# Altium project soldeerbout.PrjPcb
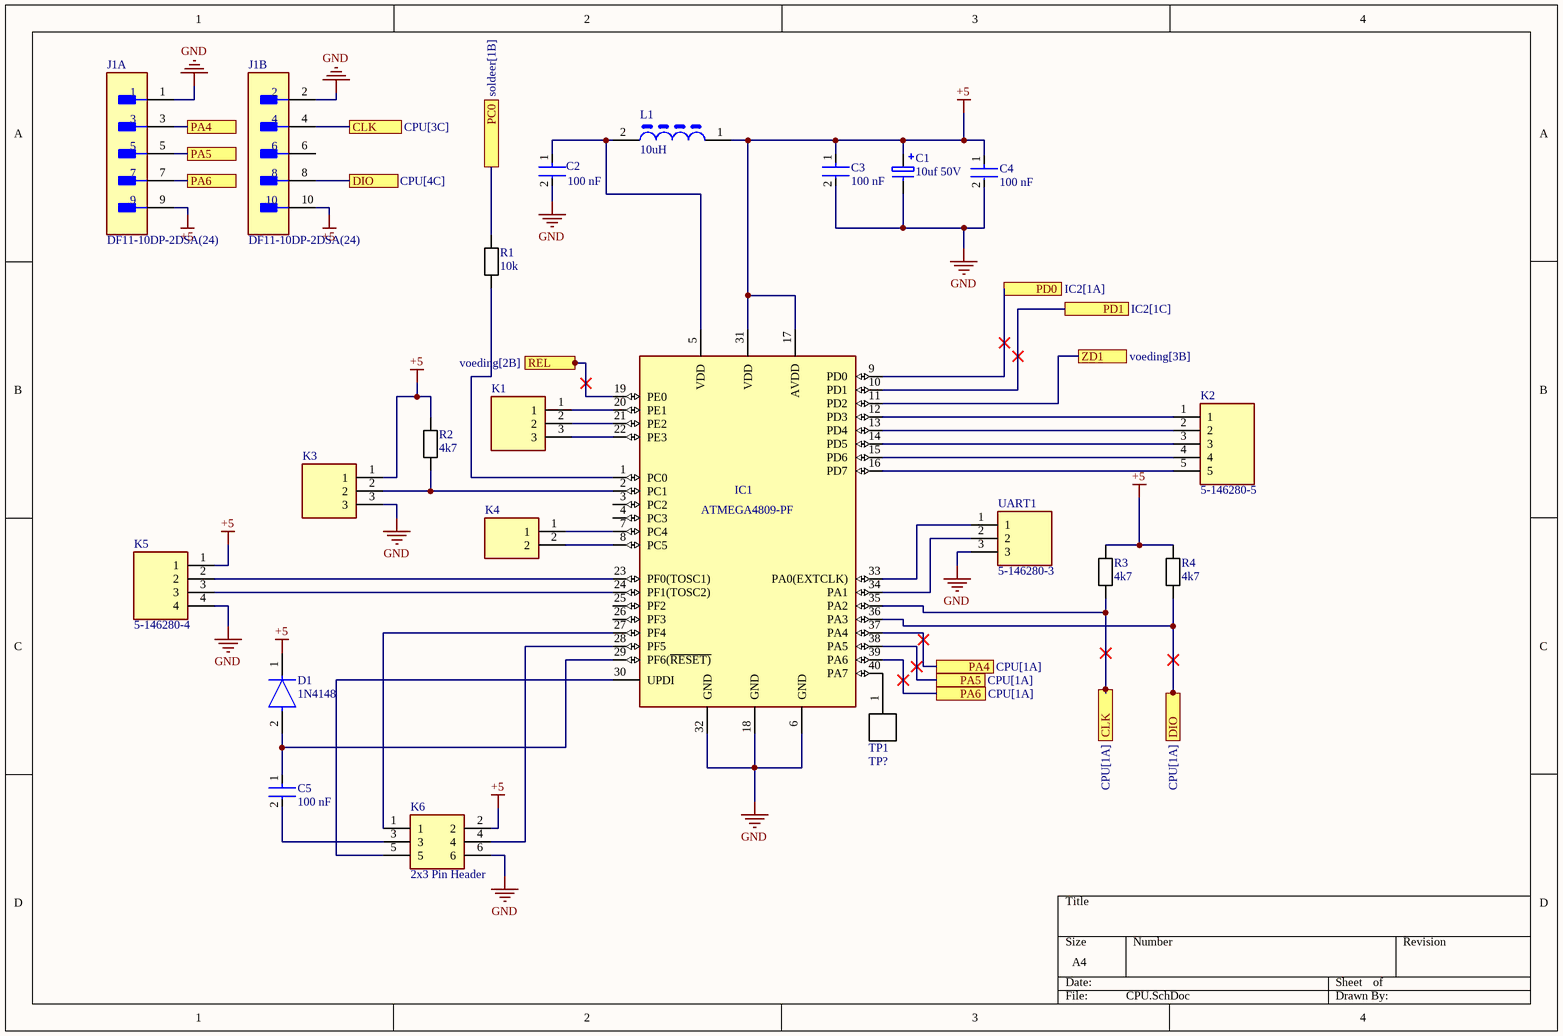
[diagram p0: CPU.SchDoc]
4 sheets, 71 parts. Net scope: flat (ports and power ports of the same name join across sheets).
Board file: PCB1.PcbDoc
Sheets:
  CPU.SchDoc
  IC2.SchDoc
  soldeer.SchDoc
  voeding.SchDoc

## Sheet CPU.SchDoc
size A4; SheetNumber: 1; SheetTotal: 4

### Parts
C1  10uf 50V  [Elco 10uF 50V]
C2  100 nF  [0805]
C3  100 nF  [0805]
C4  100 nF  [0805]
C5  100 nF  [0805]
D1  1N4148  [1N4148]
IC1  ATMEGA4809-PF  [FP-C04-016-MFG]
J1  DF11-10DP-2DSA(24)  [FP-DF11-10DP-2DSA_24-MFG - duplicate]  (parts A,B of 2)
K1  5-146280-3  [3 Pin Header]  (value not drawn)
K2  5-146280-5  [5 Pin Header]
K3  5-146280-3  [3 Pin Header]  (value not drawn)
K4  5-146280-2  [2 Pin Header]  (value not drawn)
K5  5-146280-4  [4 Pin Header]
K6  2x3 Pin Header  [2x3 Pin Header]
L1  10uH  [Smoorspoel]
R1  10k  [registor]
R2  4k7  [registor]
R3  4k7  [registor]
R4  4k7  [registor]
TP1  TP?  [testpunt]
UART1  5-146280-3  [3 Pin Header]

### Ports
CLK (see CPU[1A]), CLK (see CPU[3C]), DIO (see CPU[1A]), DIO (see CPU[4C]), PA4 (see CPU[1A]), PA4 (see CPU[3C]), PA5 (see CPU[1A]), PA5 (see CPU[3C]), PA6 (see CPU[1A]), PA6 (see CPU[3C]), PC0 (see soldeer[1B]), PD0 (see IC2[1A]), PD1 (see IC2[1C]), REL (see voeding[2B]), ZD1 (see voeding[3B])

### Nets
+5: C1.1 C3.1 C4.1 D1.1(C) IC1.17(AVDD) IC1.31(VDD) J1.9 J1.10 K3.1 K5.1 K6.2 L1.1 R2.2 R3.2 R4.2
GND: C1.2 C2.2 C3.2 C4.2 IC1.6(GND) IC1.18(GND) IC1.32(GND) J1.1 J1.2 K3.3 K5.4 K6.6 UART1.3
NetC2_1: C2.1 IC1.5(VDD) L1.2
NetC5_1: C5.1 D1.2(A) IC1.29(PF6(~{RESET)})
NetC5_2: C5.2 K6.3
NetC7_1: IC1.9(PD0) ; port PD0
NetC9_1: IC1.10(PD1) ; port PD1
NetIC1_1: IC1.1(PC0) R1.1
NetIC1_2: IC1.2(PC1) K3.2 R2.1
NetIC1_7: IC1.7(PC4) K4.1
NetIC1_8: IC1.8(PC5) K4.2
NetIC1_11: IC1.11(PD2) ; port ZD1
NetIC1_12: IC1.12(PD3) K2.1
NetIC1_13: IC1.13(PD4) K2.2
NetIC1_14: IC1.14(PD5) K2.3
NetIC1_15: IC1.15(PD6) K2.4
NetIC1_16: IC1.16(PD7) K2.5
NetIC1_19: IC1.19(PE0) ; port REL
NetIC1_20: IC1.20(PE1) K1.1
NetIC1_21: IC1.21(PE2) K1.2
NetIC1_22: IC1.22(PE3) K1.3
NetIC1_23: IC1.23(PF0(TOSC1)) K5.2
NetIC1_24: IC1.24(PF1(TOSC2)) K5.3
NetIC1_27: IC1.27(PF4) K6.1
NetIC1_28: IC1.28(PF5) K6.4
NetIC1_30: IC1.30(UPDI) K6.5
NetIC1_33: IC1.33(PA0(EXTCLK)) UART1.1
NetIC1_34: IC1.34(PA1) UART1.2
NetIC1_35: IC1.35(PA2) J1.4 R3.1 ; port CLK
NetIC1_36: IC1.36(PA3) J1.8 R4.1 ; port DIO
NetIC1_37: IC1.37(PA4) J1.3 ; port PA4
NetIC1_38: IC1.38(PA5) J1.5 ; port PA5
NetIC1_39: IC1.39(PA6) J1.7 ; port PA6
NetIC1_40: IC1.40(PA7) TP1.1
NetR1_2: R1.2 ; port PC0

Not connected (* = marked no-connect by the designer): IC1 3(PC2) 4(PC3) 25(PF2) 26(PF3); J1 6

### Library data of the parts
C1 = Condensator 10uf 50V: Part Number: 02015A270JAT2A; Manufacturer: AVX Interconnect / Elco
C2-C5 = Condensator 0805: Chip Multilayer Ceramic Capacitors for General Purpose, 0805, 10uF, X5R, 15%, 10%, 25V; Length: 2mm; Depth: 1.25mm; Termination: SMD/SMT; Voltage: 25V; Height: 1.25mm; Material: Ceramic; Thickness: 0.053inch; Radiation Hardening: No; Min Operating Temperature: -55°C; Width: 0.049inch; Package Quantity: 1; Mount: Surface Mount; Dielectric: X5R; Packaging: Tape and Reel; Capacitance: 10uF; Voltage Rating (DC): 25V; Lead Free: Lead Free; Max Operating Temperature: 85°C; Case Code (Imperial): 0805; Case/Package: 0805; Tolerance: 10%; Voltage Rating: 25V; Case Code (Metric): 2012
D1 = 1N4148: DIODE GEN PURP 100V 200MA DO35; Forward Voltage: 1V; Max Power Dissipation: 500mW; Max Reverse Current: 5uA; Forward Current: 300mA; Current: 4A; Reverse Recovery Time: 4ns; Element Configuration: Single; Outside Diameter: 1.85mm; Capacitance: 4pF; Polarity: Standard; Max Forward Surge Current (Ifsm): 1A; Reverse Voltage: 100V; Output Current: 200mA; Average Rectified Current: 200mA; Diameter: 1.91mm; Max Repetitive Reverse Voltage (Vrrm): 100V; Current Rating: 200mA; Case/Package: DO-35; Lead Free: Lead Free; Number of Pins: 2; Recovery Time: 4ns; Packaging: Bulk; Contact Plating: Tin; Voltage: 100V; Mount: Through Hole; Max Surge Current: 4A; Package Quantity: 2000; Width: 1.91mm; Max Reverse Voltage (DC): 100V; Length: 4.56mm; Radiation Hardening: No; Power Dissipation: 500mW; Voltage Rating (DC): 100V; Peak Non-Repetitive Surge Current: 4A; REACH SVHC: No SVHC; Height: 4.56mm; Max Operating Temperature: 175°C; Series: -; Weight: 0.01lb; Min Operating Temperature: -65°C
IC1 = CMP-06276-000616-1: IC MCU 8BIT 48KB FLASH 40DIP; RoHS Compliant: Yes
J1 = CMP-11610-000008-1: CONN HEADER VERT 10POS 2MM; Manufacturer: Hirose; Number Of Contacts: 10; Voltage Rating: 250V; Conn Orientation: Straight; Conn Gender: Male; Current Rating: 2A; Temperature Range High: +85°C; RoHS: TRUE; Device Class L2: Headers and Wire Housings; ComponentLink2URL: https://www.hirose.com/product/document?clcode=CL0543-0520-0-24&productname=DF11-10DP-2DSA(24)&series=DF11&documenttype=Catalog&lang=en&documentid=D31688_en; Height: 6.9mm; Package: DF11-10DP-2DSA(24); ComponentLink2Description: Datasheet; Automotive: No; Digikey Description: CONN HEADER VERT 10POS 2MM; Manufacturer Part Number: DF11-10DP-2DSA(24); Temperature: -40°C to +85°C; Octopart: https://octopart.com/df11-10dp-2dsa%2824%29-hirose-39521433; Number Of Rows: 2; Device Class L3: unset; Contact Material: Tin,Nickel; Mouser Description: Headers & Wire Housings 10P STRT HEADER THRU HL,BD MNT,SN; Category: Conn; Device Class L1: Connectors; Temperature Range Low: -40°C; Pitch: 2mm; Lead Free: Yes; Footprint Url: https://www.hirose.com/product/document?clcode=CL0543-0520-0-24&productname=DF11-10DP-2DSA(24)&series=DF11&documenttype=2DDrawing&lang=en&documentid=0000995333
K1 K3 UART1 = 3 Pin Header L: Connector 5-146280-3; Manufacturer_Name: TE Connectivity; Datasheet Link: https://componentsearchengine.com//5-146280-3.pdf; Height: 8.21mm; Mouser2 Part Number: 571-5-146280-3; Mouser2 Price/Stock: https://www.mouser.com/Search/Refine.aspx?Keyword=571-5-146280-3; Manufacturer_Part_Number: 5-146280-3
K2 = 5 Pin Header: Connector 5-146280-5; Manufacturer_Name: TE Connectivity; Datasheet Link: https://componentsearchengine.com//5-146280-5.pdf; Height: 8.21mm; Mouser2 Part Number: 571-5-146280-5; Mouser2 Price/Stock: https://www.mouser.com/Search/Refine.aspx?Keyword=571-5-146280-5; Manufacturer_Part_Number: 5-146280-5
K4 = 2 Pin Header L: Connector; Manufacturer_Name: TE Connectivity; Datasheet Link: http://www.te.com/commerce/DocumentDelivery/DDEController?Action=showdoc&DocId=Customer+Drawing%7F146280%7FH2%7Fpdf%7FEnglish%7FENG_CD_146280_H2.pdf%7F5-146280-2; Height: 8.72mm; Manufacturer_Part_Number: 5-146280-2
K5 = 4 Pin Header L: Connector 5-146280-4; Manufacturer_Name: TE Connectivity; Datasheet Link: https://datasheet.datasheetarchive.com/originals/distributors/DKDS-20/396066.pdf; Height: 8.21mm; Manufacturer_Part_Number: 5-146280-4
K6 = 2x3 Pin Header: Connector; Manufacturer_Name: TE Connectivity; Manufacturer_Part_Number: 5-146256-3; Datasheet Link: https://www.te.com/commerce/DocumentDelivery/DDEController?Action=srchrtrv&DocNm=146256&DocType=Customer+Drawing&DocLang=English; Height: 8.72mm
L1 = Smoorspoel: Inductor VLS6045EX-100M-H; Manufacturer_Name: TDK; Datasheet Link: https://componentsearchengine.com//VLS6045EX-100M-H.pdf; Mouser2 Part Number: 810-VLS6045EX-100M-H; Mouser2 Price/Stock: https://www.mouser.com/Search/Refine.aspx?Keyword=810-VLS6045EX-100M-H; Manufacturer_Part_Number: VLS6045EX-100M-H
R1-R4 = resistor: Manufacturer: Vishay Dale; Part Number: CRCW08050000Z0EA
TP1 = testpunt

## Sheet IC2.SchDoc
size A4; SheetNumber: 2; SheetTotal: 4
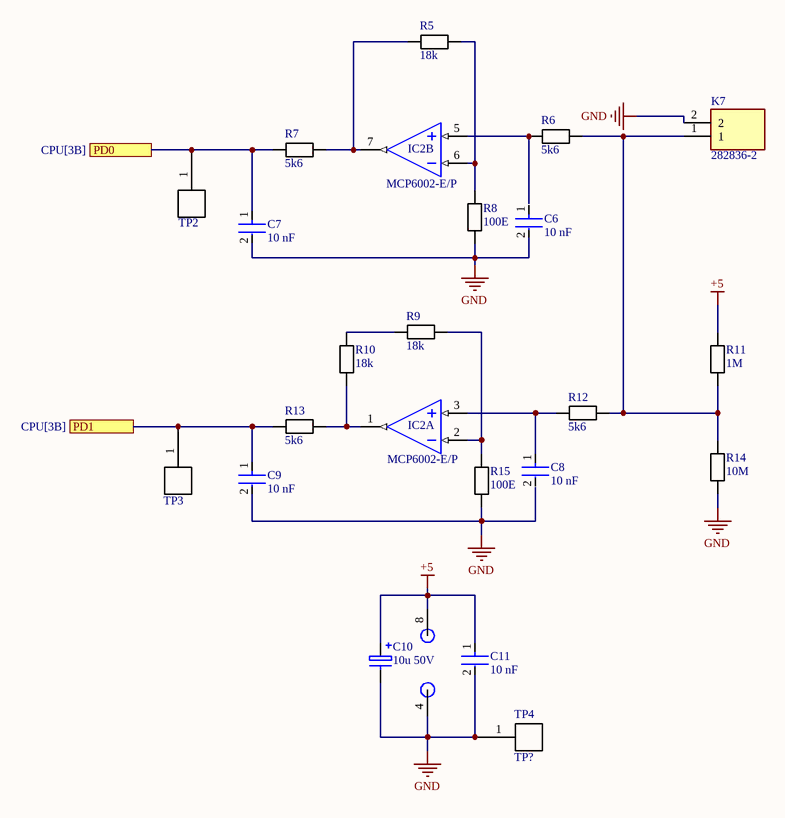
[diagram p1: IC2.SchDoc]

### Parts
C6  10 nF  [0805]
C7  10 nF  [0805]
C8  10 nF  [0805]
C9  10 nF  [0805]
C10  10u 50V  [Elco 10uF 50V]
C11  10 nF  [0805]
IC2  MCP6002-E/P  [MCP6002-E/P]  (parts A,B of 2)
K7  282836-2  [Schroefconnector 2 Pin]
R5  18k  [registor]
R6  5k6  [registor]
R7  5k6  [registor]
R8  100E  [registor]
R9  18k  [registor]
R10  18k  [registor]
R11  1M  [registor]
R12  5k6  [registor]
R13  5k6  [registor]
R14  10M  [registor]
R15  100E  [registor]
TP2  TP2  [testpunt]  (value not drawn)
TP3  TP?  [testpunt]  (value not drawn)
TP4  TP?  [testpunt]

### Ports
PD0 (see CPU[3B]), PD1 (see CPU[3B])

### Nets
+5: C10.1 C11.1 IC2.8 R11.1
GND: C6.2 C7.2 C9.2 C10.2 C11.2 IC2.4 K7.2 R8.1 R14.1 R15.1 TP4.1
NetC7_1: C7.1 R7.1 TP2.1 ; port PD0
NetC8_1: C8.1 IC2.3(VINA+) R12.1
NetC9_1: C9.1 R13.1 TP3.1 ; port PD1
NetIC2_1: IC2.1(VOUTA) R10.2 R13.2
NetIC2_2: IC2.2(VINA-) R9.1 R15.2
NetIC2_5: IC2.5(VINB+) R6.1
NetIC2_6: IC2.6(VINB-) R5.2 R8.2
NetIC2_7: IC2.7(VOUTB) R5.1 R7.2
NetK7_1: K7.1 R6.2 R11.2 R12.2 R14.2
NetR9_2: R9.2 R10.1

Not connected (* = marked no-connect by the designer): C6 1; C8 2

### Library data of the parts
C6-C9 C11 = Condensator 0805: as C2 on sheet CPU; Length: 2mm; Depth: 1.25mm; Termination: SMD/SMT; Voltage: 25V; Height: 1.25mm; Material: Ceramic; Thickness: 0.053inch; Radiation Hardening: No; Min Operating Temperature: -55°C; Width: 0.049inch; Package Quantity: 1; Mount: Surface Mount; Dielectric: X5R; Packaging: Tape and Reel; Capacitance: 10uF; Voltage Rating (DC): 25V; Lead Free: Lead Free; Max Operating Temperature: 85°C; Case Code (Imperial): 0805; Case/Package: 0805; Tolerance: 10%; Voltage Rating: 25V; Case Code (Metric): 2012
C10 = Condensator Elco: Part Number: 02015A270JAT2A; Manufacturer: AVX Interconnect / Elco
IC2 = MCP6002-E/P: None; Slew Rate: 0.6V/µs; Supply Current: 100uA; Power Supply Rejection Ratio (PSRR): 86dB; Input Offset Voltage (Vos): 4.5mV; Input Bias Current: 1pA; Amplifier Type: GENERAL PURPOSE; Unity Gain Bandwidth Product: 1MHz; Number of Circuits: 2; Output Current: 23mA; Operating Supply Voltage: 5.5V; Min Supply Voltage: 1.8V; Common Mode Rejection Ratio: 60dB; Voltage Gain: 112dB; Max Supply Voltage: 6V; Package Quantity: 60; REACH SVHC: No SVHC; Min Operating Temperature: -40°C; Max Operating Temperature: 125°C; Mount: Through Hole; Nominal Supply Current: 100uA; Height: 3.3mm; Length: 9.27mm; Slew Rate-Nom: 0.6V/µs; Packaging: Rail/Tube; Output Current per Channel: 23mA; Number of Amplifiers: 2; RoHS Compliant: Yes; Radiation Hardening: No; Bandwidth: 1MHz; Lead Free: Lead Free; Width: 6.35mm; Number of Channels: 2; Gain Bandwidth Product: 1MHz; Technology: CMOS; Operating Supply Current: 100uA; Number of Elements: 2; Number of Pins: 8; Input Offset Voltage-Max: 4.5mV; Case/Package: PDIP
K7 = Schroefconnector 2 Pin L: Connector; Manufacturer_Name: TE Connectivity; Datasheet Link: https://www.te.com/commerce/DocumentDelivery/DDEController?Action=showdoc&DocId=Customer+Drawing%7F282836%7FJ%7Fpdf%7FEnglish%7FENG_CD_282836_J.pdf%7F282836-2; Height: 10mm; Manufacturer_Part_Number: 282836-2
R5-R15 = resistor: as R1 on sheet CPU
TP2-TP4 = testpunt

## Sheet soldeer.SchDoc
size A4; SheetNumber: 3; SheetTotal: 4
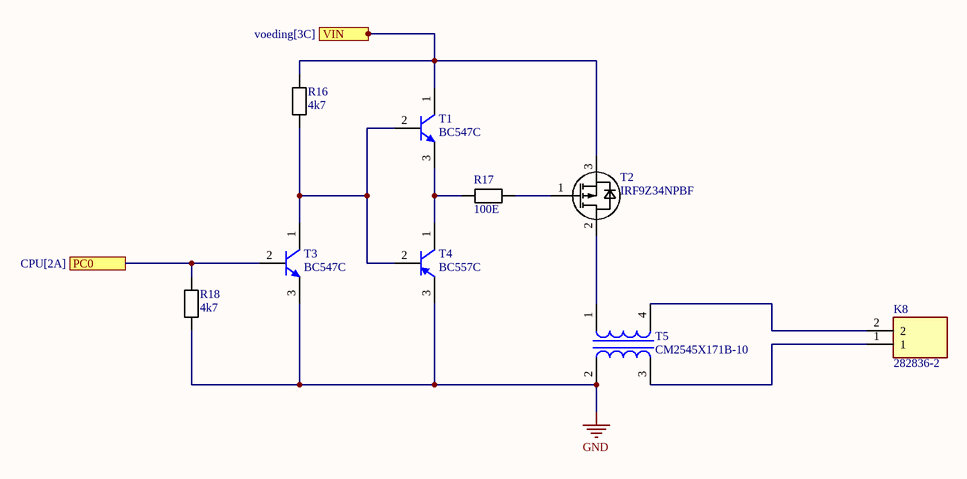
[diagram p2: soldeer.SchDoc]

### Parts
K8  282836-2  [Schroefconnector 2 Pin]
R16  4k7  [registor]
R17  100E  [registor]
R18  4k7  [registor]
T1  BC547C  [BC547C]
T2  IRF9Z34NPBF  [IRF9Z34NPBF]
T3  BC547C  [BC547C]
T4  BC557C  [BC557C]
T5  CM2545X171B-10  [CM2545X171B-10]

### Ports
PC0 (see CPU[2A]), VIN (see voeding[3C])

### Nets
GND: R18.1 T3.3(E) T4.3(E) T5.2
NetF1_1: R16.2 T1.1(C) T2.3(SOURCE) ; port VIN
NetK8_1: K8.1 T5.3
NetK8_2: K8.2 T5.4
NetR1_2: R18.2 T3.2(B) ; port PC0
NetR16_1: R16.1 T1.2(B) T3.1(C) T4.2(B)
NetR17_1: R17.1 T1.3(E) T4.1(C)
NetR17_2: R17.2 T2.1(GATE)
NetT2_2: T2.2(DRAIN) T5.1

### Library data of the parts
K8 = Schroefconnector 2 Pin L: as K7 on sheet IC2; Datasheet Link: https://www.te.com/commerce/DocumentDelivery/DDEController?Action=showdoc&DocId=Customer+Drawing%7F282836%7FJ%7Fpdf%7FEnglish%7FENG_CD_282836_J.pdf%7F282836-2; Height: 10mm; Manufacturer_Part_Number: 282836-2
R16-R18 = resistor: as R1 on sheet CPU
T1 T3 = BC547C: Amplifier Transistor, NPN Silicon, 3-Pin TO-92, Pb-Free, Bulk Box; Manufacturer: On Semiconductor; PartNumber: BC547CG; IC Continuous (A): 0.1; fT Min (MHz): 150; ComponentLink3URL: http://www.onsemi.cn/pub_link/Collateral/2N6426-D.PDF; Mounting Technology: Through Hole; PackageReference: TO-92-3-29-11_AM_SL; ComponentLink2Description: Datasheet; RoHS: TRUE; Packing: Bulk Box; ComponentLink1Description: Manufacturer URL; PackageDescription: 3-Pin Transistor Outline, Body 4.825 x 3.685 mm, Pitch 1.27 mm; PackageVersion: Rev. AM; ComponentLink2URL: http://www.onsemi.com/pub_link/Collateral/BC546-D.PDF; ComponentLink3Description: Package Specification; ComponentLink1URL: http://www.onsemi.com/; DatasheetVersion: Rev. 7; Polarity: NPN
T2 = IRF9Z34NPBF: OptiMOS - P2 Power-Transistor, P-channel-Enhancement mode, VDS -30V; Manufacturer: Infineon Technologies; Manufacturer Order NumberManufacturer Order Number: IRF9Z34N; PackageReference: PG-TO220-3-904
T4 = BC557C: Amplifier Transistor, PNP Silicon, 3-Pin TO-92, Bulk Box; Manufacturer: On Semiconductor; IC Continuous (A): -0.1; Polarity: PNP; PartNumber: BC557C; PackageVersion: Rev. AM; RoHS: FALSE; PackageDescription: 3-Pin Transistor Outline, Body 4.825 x 3.685 mm, Pitch 1.27 mm; Packing: Bulk Box; ComponentLink2Description: Datasheet; DatasheetVersion: Rev. 3; ComponentLink3Description: Package Specification; Mounting Technology: Through Hole; ComponentLink2URL: http://www.onsemi.com/pub_link/Collateral/BC556B-D.PDF; ComponentLink1URL: http://www.onsemi.com/; ComponentLink1Description: Manufacturer URL; ComponentLink3URL: http://www.onsemi.cn/pub_link/Collateral/2N6426-D.PDF; PackageReference: TO-92-3-29-11_AM_SL
T5 = CM2545X171B-10: 2 Line Common Mode Choke Through Hole 170 Ohms @ 100 MHz 10A DCR 10mOhm; MF: Laird; Value: *; Purchase-URL: https://pricing.snapeda.com/search/part/CM2545X171B-10/?ref=eda; Price: None; Package: Vertical-4 Laird; SnapEDA_Link: https://www.snapeda.com/parts/CM2545X171B-10/Laird/view-part/?ref=snap; Availability: In Stock; Check_prices: https://www.snapeda.com/parts/CM2545X171B-10/Laird/view-part/?ref=eda; MP: CM2545X171B-10

## Sheet voeding.SchDoc
size A4; SheetNumber: 4; SheetTotal: 4
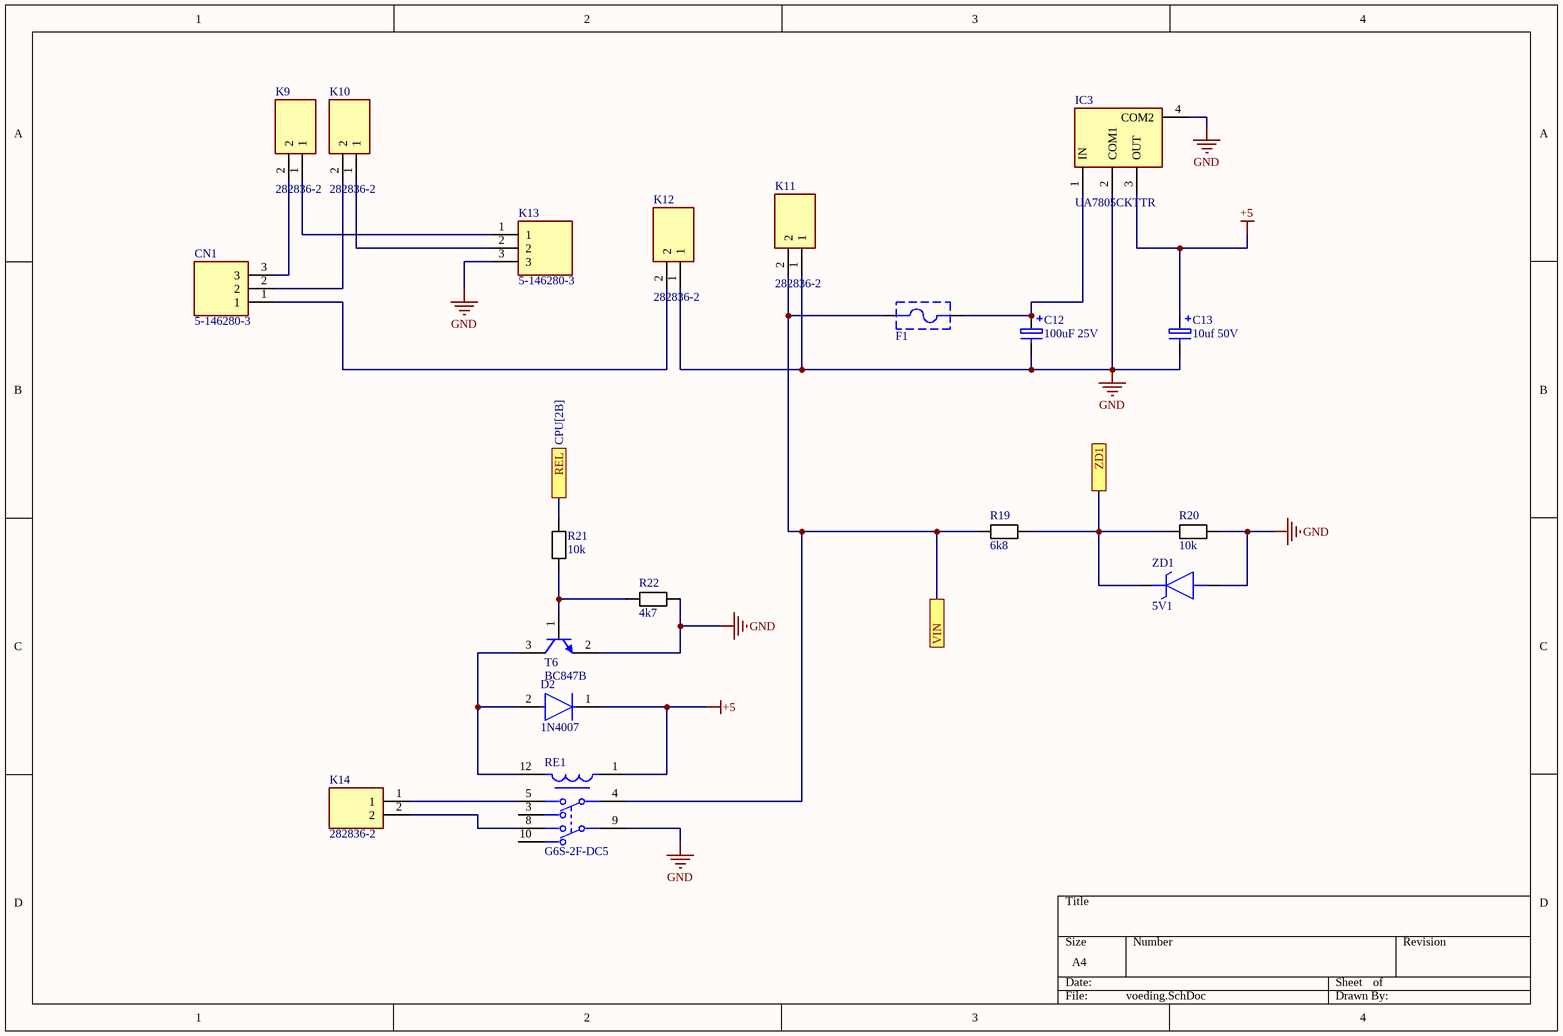
[diagram p3: voeding.SchDoc]

### Parts
C12  100uF 25V  [Elco 100uF 25V]
C13  10uf 50V  [Elco 10uF 50V]
CN1  5-146280-3  [3 Pin Header]
D2  1N4007  [1N4007]
F1  696101000002  [zekeringhouder]  (value not drawn)
IC3  UA7805CKTTR  [FP-KTT0003A-MFG]
K9  282836-2  [Schroefconnector 2 Pin]
K10  282836-2  [Schroefconnector 2 Pin]
K11  282836-2  [Schroefconnector 2 Pin]
K12  282836-2  [Schroefconnector 2 Pin]
K13  5-146280-3  [3 Pin Header]
K14  282836-2  [Schroefconnector 2 Pin]
R19  6k8  [registor]
R20  10k  [registor]
R21  10k  [registor]
R22  4k7  [registor]
RE1  G6S-2F-DC5  [FP-G6S-2F-DC5-MFG]
T6  BC847B  [INF-SOT23_L]
ZD1  5V1  [SOD3716X135N]

### Ports
REL (see CPU[2B]), VIN (see soldeer[2A]), ZD1 (see CPU[3B])

### Nets
+5: C13.1 D2.1(C) IC3.3(OUT) RE1.1
GND: C12.2 C13.2 IC3.2(COM1) IC3.4(COM2) K11.1 K12.1 K13.3 R20.2 R22.2 RE1.9 T6.2(E) ZD1.2(A)
NetC12_1: C12.1 F1.2 IC3.1(IN)
NetCN1_1: CN1.1 K12.2
NetCN1_2: CN1.2 K10.2
NetCN1_3: CN1.3 K9.2
NetD2_2: D2.2(A) RE1.12 T6.3(C)
NetF1_1: F1.1 K11.2 R19.1 RE1.4 ; port VIN
NetIC1_11: R19.2 R20.1 ZD1.1(K) ; port ZD1
NetIC1_19: R21.2 ; port REL
NetK9_1: K9.1 K13.1
NetK10_1: K10.1 K13.2
NetK14_1: K14.1 RE1.5
NetK14_2: K14.2 RE1.8
NetR21_1: R21.1 R22.1 T6.1(B)

Not connected (* = marked no-connect by the designer): RE1 3 10

### Library data of the parts
C12 = Condensator 100uF 25V: Part Number: 02015A270JAT2A; Manufacturer: AVX Interconnect / Elco
C13 = Condensator 10uf 50V: as C1 on sheet CPU
CN1 = 3 Pin Header: Connector 5-146280-3; Manufacturer_Name: TE Connectivity; Datasheet Link: https://componentsearchengine.com//5-146280-3.pdf; Height: 8.21mm; Mouser2 Part Number: 571-5-146280-3; Mouser2 Price/Stock: https://www.mouser.com/Search/Refine.aspx?Keyword=571-5-146280-3; Manufacturer_Part_Number: 5-146280-3
D2 = 1N4007: Rectifier diode 1000 V 1 A DO-41, ,; Manufacturer: Diotec; Max Surge Forward Current: 27A; Forward Current: 1A; Max Junction Temp: +175°C; Reverse Voltage: 1000V; Value: 15pF; Peak Reverse Current: 5uA; Category: Diode; Temperature Range Low: -50°C; Automotive: No; Temperature: -50°C to +175°C; Lead Free: Yes; ComponentLink2Description: Datasheet; Max Repetitive Reverse Voltage: 1000V; ComponentLink2URL: https://datasheet.octopart.com/1N4007-Diotec-datasheet-62346875.pdf; Manufacturer Part Number: 1N4007; Device Class L3: Rectifier Diodes; Height: 2.8mm; Octopart: https://octopart.com/1n4007-diotec-4040411; Package: 1N4007; Temperature Range High: +175°C; Device Class L1: Discrete Semiconductors; Device Class L2: Diodes; RoHS: TRUE; Capacitance: 15pF; Ipc Land Pattern Name: DIOAD888W100L520D280
F1 = zekeringhouder: WR-FSH Fuseholder THT Blocks PCB Clip Cover; Manufacturer: Wurth Elektronik; Fuse Size: 5x20mm; ComponentLink1Description: Website Link; ComponentLink1URL: https://www.we-online.com/redexpert/article/696101000002?ad; ComponentLink2Description: Datasheet Link; ComponentLink2URL: https://www.we-online.com/redexpert/spec/696101000002?ad; Manufacturer Part Number: 696101000002; Category: Fuse Holder; Match Code: WR-FSH; Mount: THT; Operating Temperature Max: 120°C; Operating Temperature Min: -30°C; Packaging: Box
IC3 = IC4: IC REG LIN 5V 1.5A DDPAK/TO263-3; Output Type: Fixed; Quiescent Current: 8mA; Dropout Voltage: 2V; Max Input Voltage: 25V; Number of Regulators: 1; Max Output Voltage: 5.2V; Polarity: Positive; Min Output Voltage: 4.8V; Power Supply Rejection Ratio (PSRR): 78dB; Min Input Voltage: 7V; Power Rating: 15W; Number of Pins: 3; Output Voltage: 5V; Max Output Current: 1.5A; Nominal Output Voltage: 5V; Case/Package: TO-263; Width: 9.65mm; REACH SVHC: No SVHC; Max Operating Temperature: 125°C; Output Current: 1.5A; Weight: 0.050897oz; Contact Plating: Tin; Packaging: Tape and Reel; Mount: Surface Mount; Radiation Hardening: No; Lead Free: Lead Free; Min Operating Temperature: 0°C; Length: 10.67mm; Package Quantity: 1; Number of Outputs: 1; Height: 4.83mm
K9-K12 K14 = Schroefconnector 2 Pin L: as K7 on sheet IC2; Datasheet Link: https://www.te.com/commerce/DocumentDelivery/DDEController?Action=showdoc&DocId=Customer+Drawing%7F282836%7FJ%7Fpdf%7FEnglish%7FENG_CD_282836_J.pdf%7F282836-2; Height: 10mm; Manufacturer_Part_Number: 282836-2
K13 = 3 Pin Header L: as K1 on sheet CPU; Datasheet Link: https://componentsearchengine.com//5-146280-3.pdf; Height: 8.21mm; Mouser2 Part Number: 571-5-146280-3; Mouser2 Price/Stock: https://www.mouser.com/Search/Refine.aspx?Keyword=571-5-146280-3; Manufacturer_Part_Number: 5-146280-3
R19-R22 = resistor: as R1 on sheet CPU
RE1 = CMP-08823-000012-1: RELAY TELECOM DPDT 2A 5VDC; Manufacturer: Omron; Coil Resistance: 178Ω; Coil Current: 28.1mA; Coil Voltage: 5V; Standoff Height: 0.35mm; Coil Power: 140mW; Coil Type: Non-Latching; Number Of Contacts: 2; RoHS: TRUE; Device Class L3: Signal Relays; Ambient Temperature Range Low: -40°C; Switching Current: 2A; Device Class L1: Electromechanical; Lead Free: Yes; Category: Relay; Digikey Description: RELAY TELECOM DPDT 2A 5VDC; Height: 9.4mm; Temperature: -40°C to +85°C; Throw Configuration: DPDT; Octopart: https://octopart.com/g6s-2f-dc5-omron-85236; Package: G6S-2F-DC5; Temperature Range High: +85°C; Automotive: No; Current Rating: 2A; Manufacturer Part Number: G6S-2F-DC5; Mouser Description: Electromechanical Relay 5VDC 178Ohm 2A DPDT (14.8x9.2x9.2)mm SMD Signal Relay; Temperature Range Low: -40°C; Device Class L2: Relays; Ambient Temperature Range High: +85°C; ComponentLink2URL: https://omronfs.omron.com/en_US/ecb/products/pdf/en-g6s.pdf; ComponentLink2Description: Datasheet
T6 = BC847B: NPN Silicon AF Transistor, 45 V VCEO, 100 mA IC, SOT23, Reel, Green; Manufacturer: Infineon; VEBO (max): 6Â V; ICBO (max): 15Â nA; VCBO (max): 50Â V; IBM (max): 200Â mA; Green: TRUE; Ptot (max): 330Â mW; fT (typ): 250Â MHz; IC (max): 100Â mA; VCEO (max): 45Â V; PackageDescription: 3-Pin Small Outline Transistor Package, 1.3 x 2.9 mm Body, 0.95 mm Pitch; ComponentLink3URL: http://www.infineon.com/dgdl/SOT23-Package_Overview.pdf?folderId=db3a30431936bc4b0119532290053c66&fileId=db3a30431936bc4b0119533468123c85; PackageVersion: Apr-08; Packing: Reel; ComponentLink3Description: Package Specification; ComponentLink2URL: http://www.infineon.com/dgdl/bc847series_bc848series_bc849series_bc850series.pdf?folderId=db3a304314dca389011541d30fa21656&fileId=db3a304314dca389011541d4630a1657; ComponentLink1URL: http://www.infineon.com/; ComponentLink2Description: Datasheet; Polarity: NPN; Mounting Technology: Surface Mount; PackageReference: SOT23; ICM (max): 200Â mA; ComponentLink1Description: Manufacturer URL; PartNumber: BC847B
ZD1 = MMSZ4689T1G: Zener Diode; Manufacturer_Name: ON Semiconductor; Datasheet Link: http://www.onsemi.com/pub/Collateral/MMSZ4678T1-D.PDF; Height: 1.35mm; Manufacturer_Part_Number: MMSZ4689T1G; Mouser Part Number: 863-MMSZ4689T1G; Mouser Price/Stock: https://www.mouser.co.uk/ProductDetail/ON-Semiconductor/MMSZ4689T1G/?qs=P4IOph%252Bbot%252Blaz%2FZtdyBaA%3D%3D; Arrow Part Number: MMSZ4689T1G; Arrow Price/Stock: https://www.arrow.com/en/products/mmsz4689t1g/on-semiconductor

## Nets that join several sheets
+5: CPU (15 pins), IC2 (C10.1 C11.1 IC2.8 R11.1), voeding (C13.1 D2.1 IC3.3 RE1.1)
GND: CPU (13 pins), IC2 (11 pins), soldeer (R18.1 T3.3 T4.3 T5.2), voeding (12 pins)
NetC7_1: CPU (IC1.9), IC2 (C7.1 R7.1 TP2.1)
NetC9_1: CPU (IC1.10), IC2 (C9.1 R13.1 TP3.1)
NetF1_1: soldeer (R16.2 T1.1 T2.3), voeding (F1.1 K11.2 R19.1 RE1.4)
NetIC1_11: CPU (IC1.11), voeding (R19.2 R20.1 ZD1.1)
NetIC1_19: CPU (IC1.19), voeding (R21.2)
NetR1_2: CPU (R1.2), soldeer (R18.2 T3.2)